# EAGLE design pittl_board (EAGLE 9.5.1)
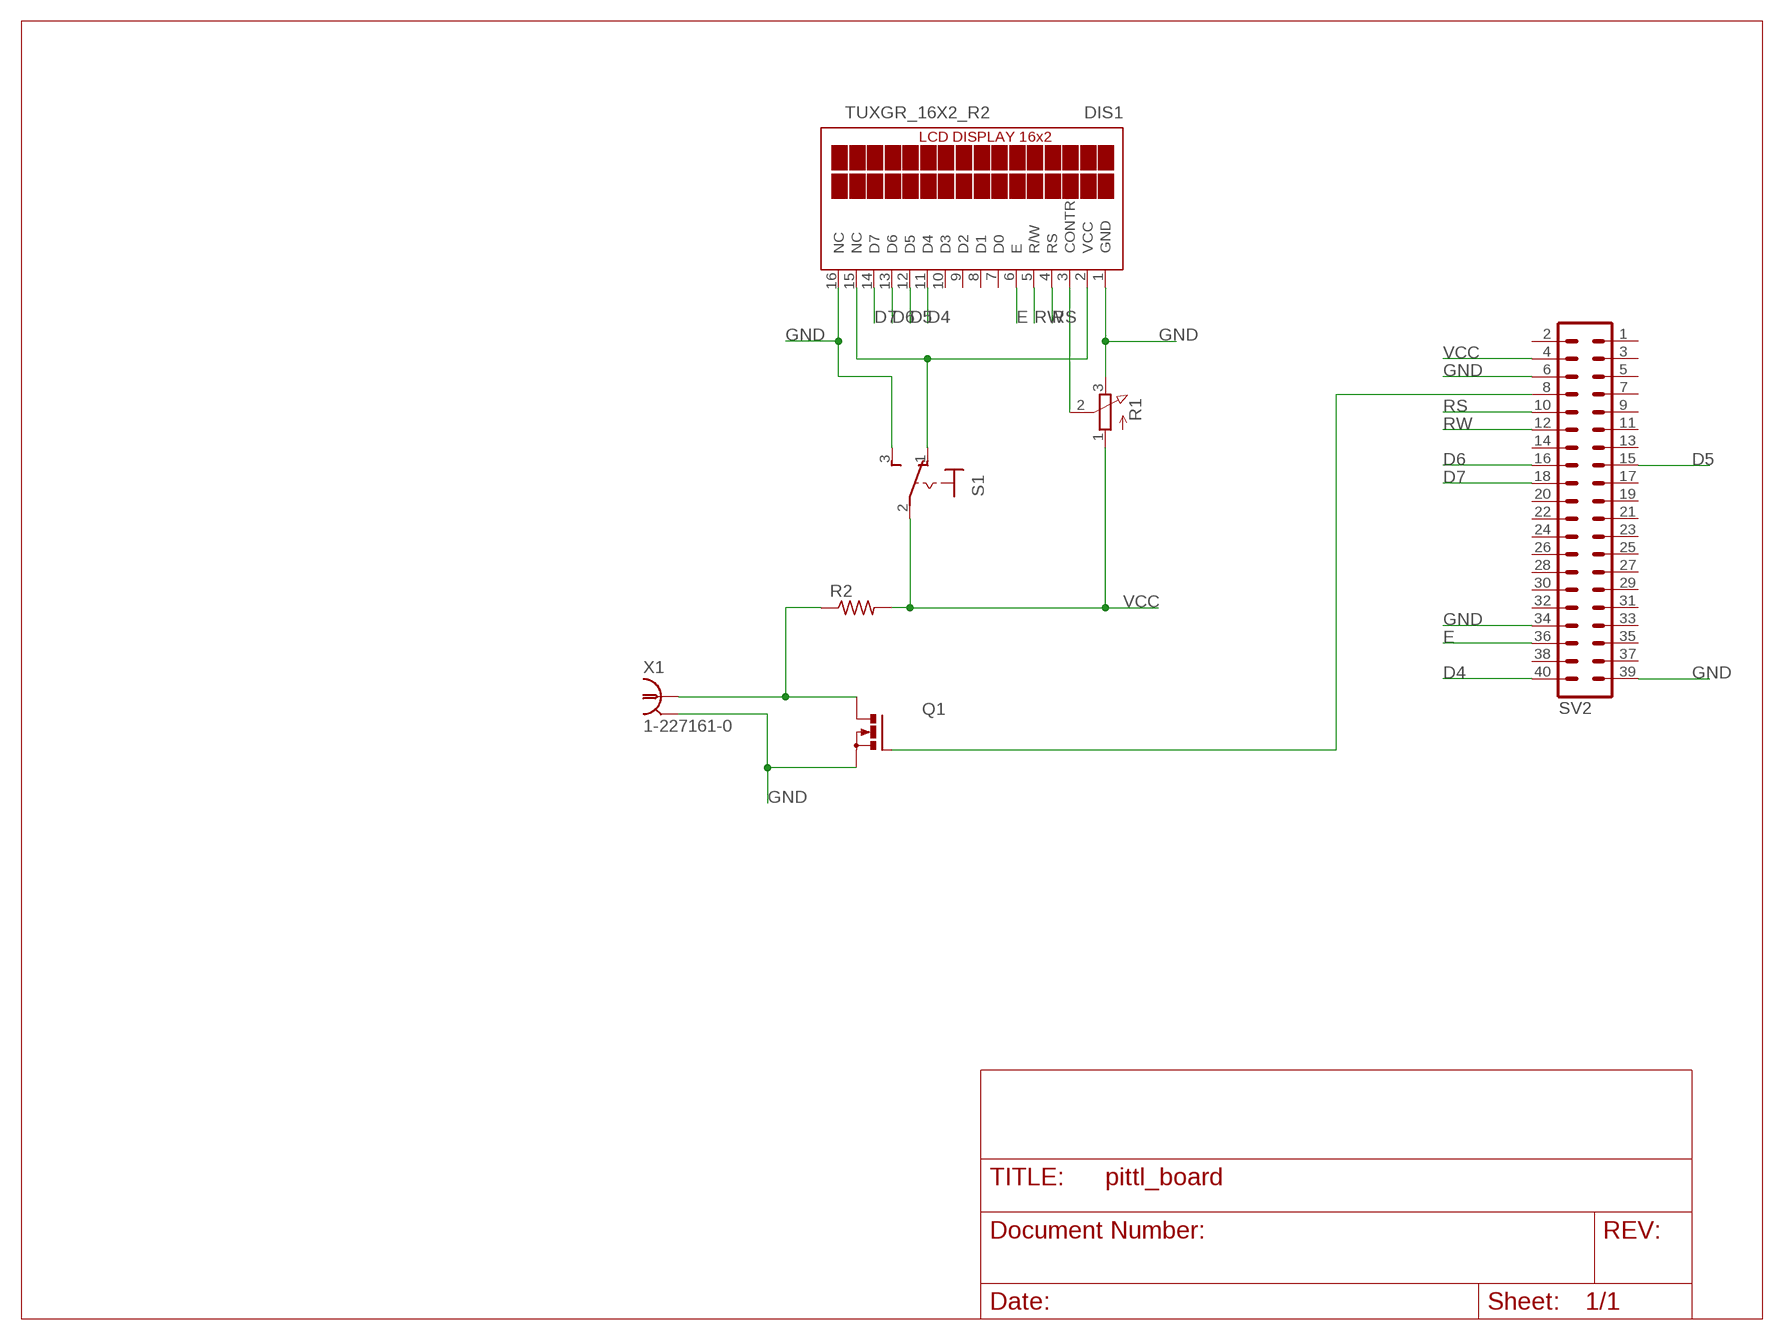
[diagram p0: schematic, sheet 1]

## Parts
DIS1  TUXGR_16X2_R2  [TUXGR_16X2_R2]
Q1  PMOSFET_NTO220BV  [TO220BV]
R1  3RP/1610N  [3RP/1610N]
R2  R-US_0207/7  [0207/7]
S1  320-916  [320-916]
SV2  MA20-2W  [MA20-2W]
X1  1-227161-0  [AMP_227161]

## Nets
D4: DIS1.11(D4) SV2.40
D5: DIS1.12(D5) SV2.15
D6: DIS1.13(D6) SV2.16
D7: DIS1.14(D7) SV2.18
E: DIS1.6(E) SV2.36
GND: DIS1.1(GND) DIS1.16(NC) Q1.S R1.3(E) S1.3(S) SV2.6 SV2.34 SV2.39 X1.2
N$1: Q1.G SV2.8
N$2: DIS1.2(VCC) DIS1.15(NC) S1.1(O)
N$4: DIS1.3(CONTR) R1.2(S)
N$5: Q1.D R2.1 X1.1
RS: DIS1.4(RS) SV2.10
RW: DIS1.5(R/W) SV2.12
VCC: R1.1(A) R2.2 S1.2(P) SV2.4
Unconnected: DIS1.7(D0) DIS1.8(D1) DIS1.9(D2) DIS1.10(D3) SV2.1 SV2.2 SV2.3 SV2.5 SV2.7 SV2.9 SV2.11 SV2.13 SV2.14 SV2.17 SV2.19 SV2.20 SV2.21 SV2.22 SV2.23 SV2.24 SV2.25 SV2.26 SV2.27 SV2.28 SV2.29 SV2.30 SV2.31 SV2.32 SV2.33 SV2.35 SV2.37 SV2.38

## Library data of the parts
DIS1 = display-lcd:TUXGR_16X2_R2: Tuxgraphics LCD display 16x2 characters reflective, without background light Source: tuxgr_12x2_r2.pdf; OC_FARNELL: unknown; OC_NEWARK: unknown
Q1 = transistor-power:PMOSFET_N: Power MOSFET N-Channel
R1 = pot:3RP/1610N: 16mm Potentiometer one level Source: http://www.alphapotentiometers.net/html/16mm_pot_2.html
R2 = rcl:R-US_: RESISTOR, American symbol; SPICEPREFIX: R
S1 = switch:320-916: TOGGLE SWITCH distributor RS Components
SV2 = con-lstb:MA20-2W: PIN HEADER; OC_FARNELL: unknown; OC_NEWARK: unknown
X1 = con-coax:?227161*: JACK, RIGHT ANGLE, 50 OHM, PCB, BNC Source: amp_227161.pdf; MF: TYCO ELECTRONICS; MPN: 1-227161; OC_FARNELL: unknown; OC_NEWARK: 33B3200

## Board
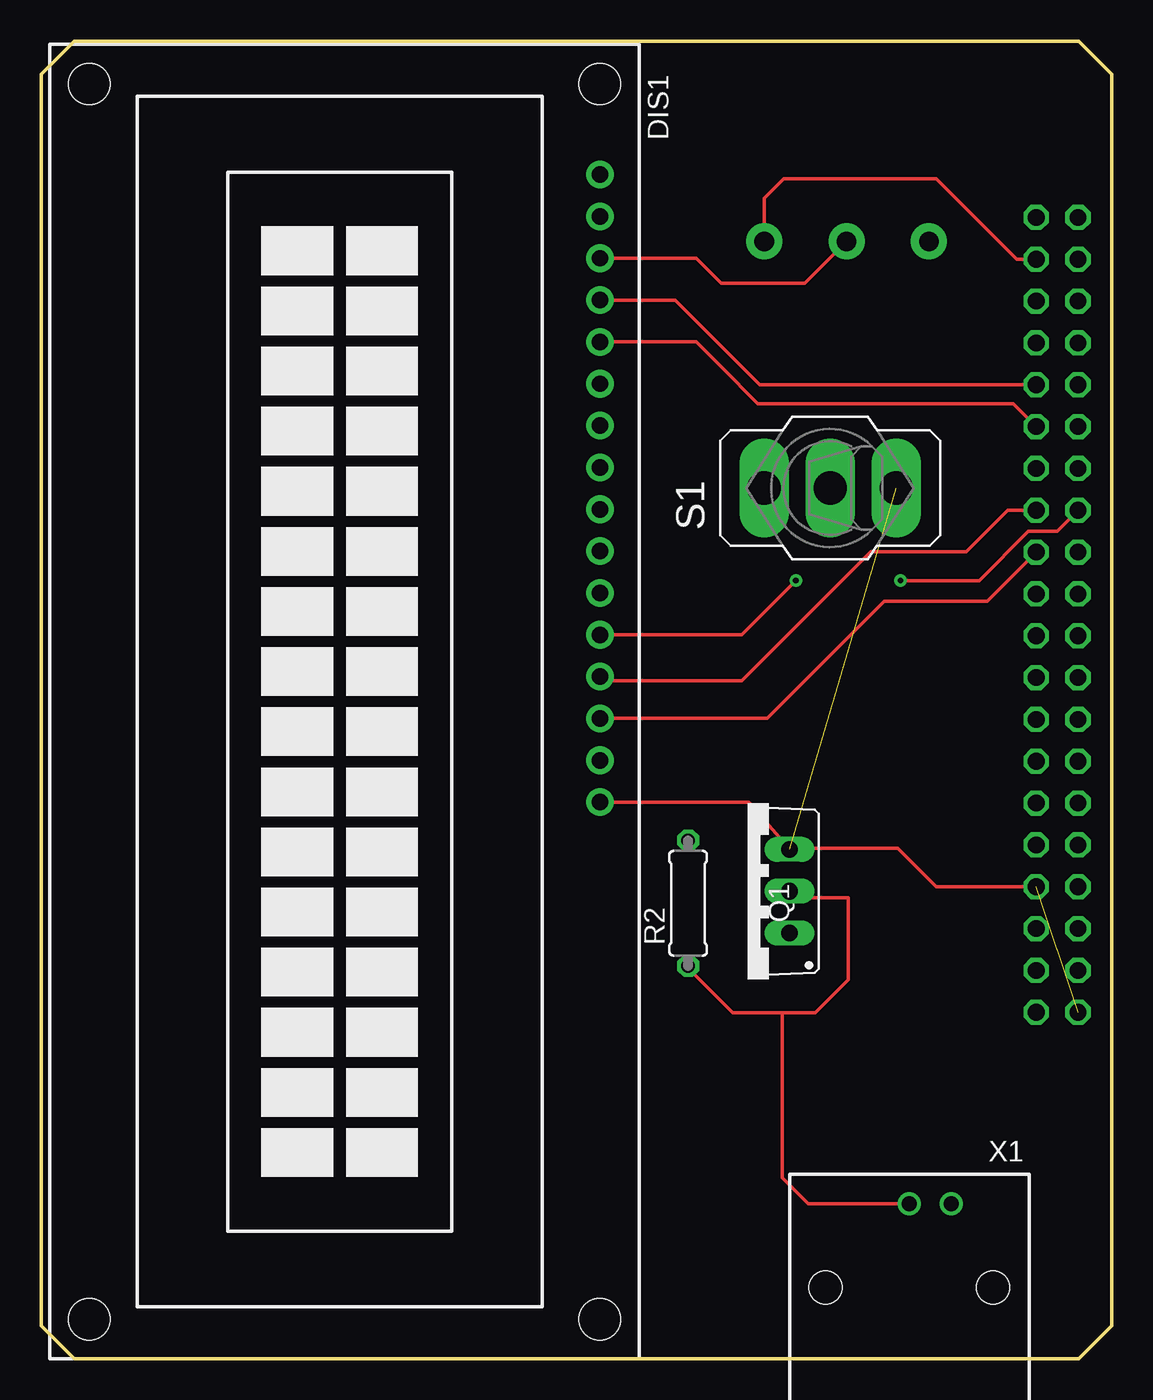
[diagram p1: board, top side]
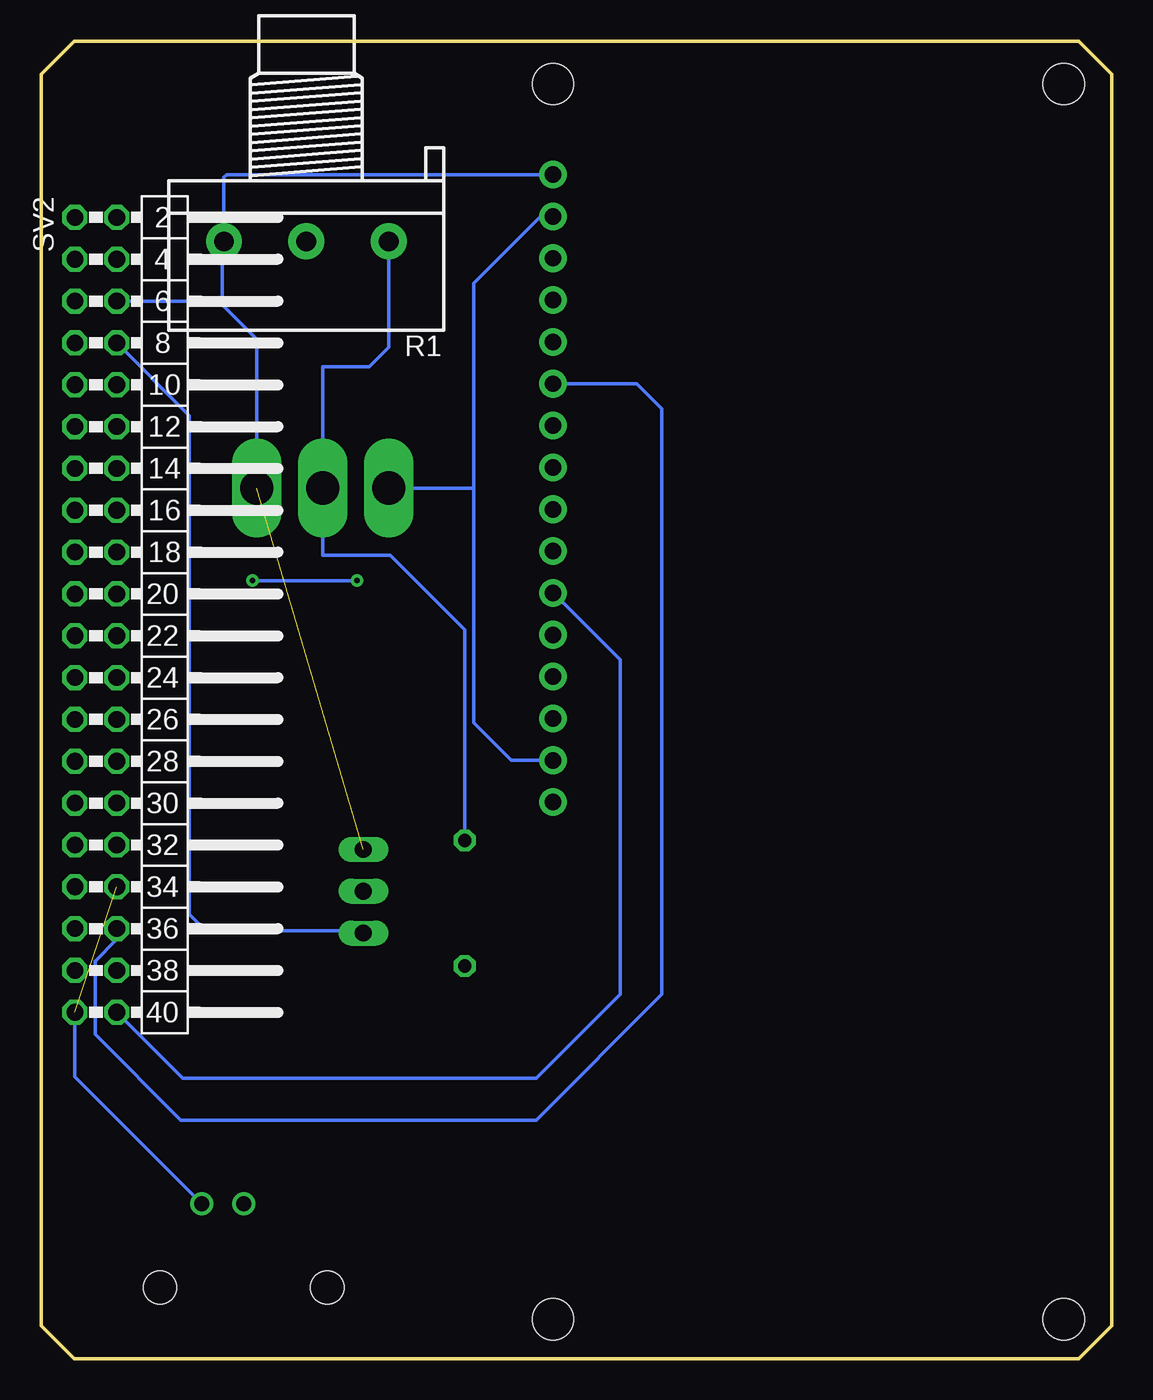
[diagram p2: board, bottom side, seen from below]

Size 65 x 80 mm. Coordinates in mm from the lower left corner, seen from the top.
Outline: 65,78 65,2 63,0 2,0 0,2 0,78 2,80 63,80 65,78
Copper layers (1*16): Top 0.035mm / dielectric 1.5mm / Bottom 0.035mm
Design rules "default": minimum track width 6mil, minimum drill 0.35mm, track to track 6mil, track to pad 6mil, pad to pad 6mil, via to via 6mil, smd to smd 6mil, copper to edge 40mil, drill to drill 6mil, minimum pad ring 10mil, minimum via ring 8mil, stop-mask expansion 4mil, vias tented up to drill 0mil, thermal gap 10mil

### Footprints (pad centres in the part's own frame; a part is rotated, then mirrored left to right if it is on the bottom)
TUXGR_16X2_R2 = drill 1 pad 1.676: 1 -32,15.5; 2 -29.46,15.5; 3 -26.92,15.5; 4 -24.38,15.5; 5 -21.84,15.5; 6 -19.3,15.5; 7 -16.76,15.5; 8 -14.22,15.5; 9 -11.68,15.5; 10 -9.14,15.5; 11 -6.6,15.5; 12 -4.06,15.5; 13 -1.52,15.5; 14 1.02,15.5; 15 3.56,15.5; 16 6.1,15.5 | hole 2.5: -37.5,-15.5; 37.5,-15.5; -37.5,15.5; 37.5,15.5
TO220BV = drill 1.016 long: D 0,-2.54; G -2.54,-2.54; S 2.54,-2.54
3RP/1610N = drill 1.2 pad 2.184: 1 -5,0; 2 0,0; 3 5,0
0207/7 = drill 0.813 octagon: 1 -3.81,0; 2 3.81,0
320-916 = drill 2.007 long: 1 0,4.013; 2 0,0; 3 0,-4.013
MA20-2W = drill 1.016 octagon: 1 -24.13,-1.27; 2 -24.13,1.27; 3 -21.59,-1.27; 4 -21.59,1.27; 5 -19.05,-1.27; 6 -19.05,1.27; 7 -16.51,-1.27; 8 -16.51,1.27; 9 -13.97,-1.27; 10 -13.97,1.27; 11 -11.43,-1.27; 12 -11.43,1.27; 13 -8.89,-1.27; 14 -8.89,1.27; 15 -6.35,-1.27; 16 -6.35,1.27; 17 -3.81,-1.27; 18 -3.81,1.27; 19 -1.27,-1.27; 20 -1.27,1.27; 21 1.27,-1.27; 22 1.27,1.27; 23 3.81,-1.27; 24 3.81,1.27; 25 6.35,-1.27; 26 6.35,1.27; 27 8.89,-1.27; 28 8.89,1.27; 29 11.43,-1.27; 30 11.43,1.27; 31 13.97,-1.27; 32 13.97,1.27; 33 16.51,-1.27; 34 16.51,1.27; 35 19.05,-1.27; 36 19.05,1.27; 37 21.59,-1.27; 38 21.59,1.27; 39 24.13,-1.27; 40 24.13,1.27
AMP_227161 = drill 0.9 pad 1.27: 1 0,-5.08; 2 -2.54,-5.08 | hole 2: -5.08,0; 5.08,0

### Placement (x,y rotation side)
DIS1  18.42,39.9 270 top
Q1  42.9,28.39 90 top
R1  48.9,67.84 180 bottom
R2  39.28,27.66 90 top
S1  47.9,52.87 90 top
SV2  61.68,45.17 270 bottom
X1  52.71,4.34 180 top

### Tracks (layer width: path | path; a pad name or v marks a point on that pad's centre or on a via)
D4
  Bottom 0.203: DIS1.11 29.85,42.44 29.85,22.12 34.93,17.04 56.41,17.04 SV2.40
D5  (via drill 0.35)
  Top 0.203: DIS1.12 42.53,43.96 v45.82,47.25 | SV2.15 61.68,50.25 59.94,50.25 56.94,47.25 v52.17,47.25
  Bottom 0.203: v52.17,47.25 v45.82,47.25
D6
  Top 0.203: DIS1.13 34.17,41.17 42.55,41.17 50.38,49 56.15,49 58.67,51.52 SV2.16
D7
  Top 0.203: DIS1.14 44.07,38.88 51.09,45.91 51.17,45.98 51.19,46 57.43,46 SV2.18
E
  Bottom 0.203: DIS1.6 28.83,59.2 27.31,57.68 27.31,22.12 34.93,14.5 56.52,14.5 61.73,19.71 61.73,24.15 60.41,25.47 SV2.36
GND  (2 unrouted)
  Top 0.203: DIS1.16 42.96,33.8 Q1.S 45.51,31 52,31 54.34,28.66 SV2.34
  Bottom 0.203: R1.3 53.9,68 | 53.9,68 53.9,71.73 53.73,71.9 DIS1.1 | 54,64 51.91,61.91 S1.3 | 54,64 54,67.9 53.9,68 | 54,64 54.22,64.22 SV2.6 | X1.2 62.95,17.12 SV2.39
N$1
  Bottom 0.203: SV2.8 56,57.27 56,27 55,26 45.59,26 Q1.G
N$2
  Bottom 0.203: DIS1.15 36.45,36.34 38.74,38.63 38.74,52.87 | 38.74,52.87 38.74,65.3 34.68,69.36 DIS1.2 | S1.1 38.74,52.87
N$4
  Top 0.203: DIS1.3 39.76,66.82 41.28,65.3 46.36,65.3 R1.2
N$5
  Top 0.203: X1.1 46.58,9.42 45,11 45,21 | Q1.D 45.83,28 49,28 49,23 47,21 45,21 | R2.1 39.28,23.72 42,21 45,21
RS
  Top 0.203: DIS1.4 38.49,64.28 43.63,59.14 SV2.10
RW
  Top 0.203: DIS1.5 39.76,61.74 42.25,59.25 42.55,58.95 43.5,58 59.01,58 SV2.12
VCC
  Top 0.203: R1.1 43.9,70.46 45.09,71.65 54.35,71.65 59.24,66.76 SV2.4
  Bottom 0.203: R2.2 39.28,44.25 43.82,48.79 47.9,48.79 S1.2 47.9,60.22 45.09,60.22 43.9,61.41 R1.1